# EAGLE design limiter (EAGLE 6.3)
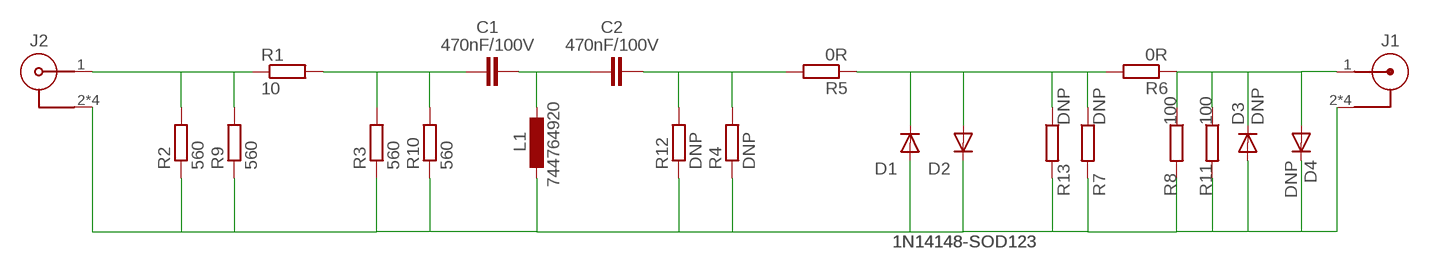
[diagram p0: schematic, sheet 1]

## Parts
C1  470nF/100V  C-EUC0805K  [C0805K]
C2  470nF/100V  C-EUC0805K  [C0805K]
D1  1N14148-SOD123  DIODE-SOD123  [SOD123]
D2  1N14148-SOD123  DIODE-SOD123  [SOD123]
D3  DNP  DIODE-SOD123  [SOD123]
D4  DNP  DIODE-SOD123  [SOD123]
J1  60314202124525  [60314202124525]
J2  60312202114509  [60312202114509]
L1  744764920  L-EUL3225M  [L3225M]
R1  10  R-EU_R0805  [R0805]
R2  560  R-EU_R0805  [R0805]
R3  560  R-EU_R0805  [R0805]
R4  DNP  R-EU_R0805  [R0805]
R5  0R  R-EU_R0805  [R0805]
R6  0R  R-EU_R0805  [R0805]
R7  DNP  R-EU_R0805  [R0805]
R8  100  R-EU_R0805  [R0805]
R9  560  R-EU_R0805  [R0805]
R10  560  R-EU_R0805  [R0805]
R11  100  R-EU_R0805  [R0805]
R12  DNP  R-EU_R0805  [R0805]
R13  DNP  R-EU_R0805  [R0805]

## Nets
GND: D1.A D2.C D3.A D4.C J1.2 J1.3 J1.4 J1.5 J2.2 J2.3 J2.4 J2.5 L1.2 R2.1 R3.1 R4.1 R7.2 R8.2 R9.1 R10.1 R11.2 R12.1 R13.2
N$1: J2.1 R1.1 R2.2 R9.2
N$2: C1.1 R1.2 R3.2 R10.2
N$3: C1.2 C2.1 L1.1
N$5: C2.2 R4.2 R5.2 R12.2
N$7: D1.C D2.A R5.1 R6.2 R7.1 R13.1
N$9: D3.C D4.A J1.1 R6.1 R8.1 R11.1

## Library data of the parts
C1 C2 = rcl:C-EU: CAPACITOR, European symbol
D1-D4 = diode:DIODE-: DIODE
J1 = 60312202111527_Eagle_WR-SMA_rev19a:60314202124525: WR-SMA PCB End Launch Plug Round Post 1.6 mm MATERIAL PROPERTIES Insulator Material PTFE Insulator Color White Center Contact Material Brass Center Contact Plating Gold, min. 0.76µm over Nickel Body Material Brass Body Plating Gold, min. 0.076µm over Nickel Coupling Nut Material Brass Coupling Nut Plating Gold, min. 0.076µm over Nickel KIND PROPERTIES Interface MIL-STD-348 Connector Type SMA Gender Plug Orientation Type Straight GENERAL INFORMATION: Operating Temperature -65 °C up to +165 °C Compliance RoHS ELECTRICAL PROPERTIES: Frequency Range DC~18 GHz MECHANICAL PROPERTIES Mating Cycle 500 Cycles PACKAGING PROPERTIES Packaging Tray <https://katalog.we-online.com/media/images/v2/o122886v209%20WR_SMA_60314202124525.jpg> Details see: https://katalog.we-online.com/en/em/WR-SMA_60314202124525 Updated by Ella Wu 2019-11-07 2019(C) Würth Elektronik; DATASHEET-URL: https://katalog.we-online.com/em/datasheet/60314202124525.pdf; GENDER: Plug; INTERFACE: MIL-STD-348; MOUNT: End Launch; ORIENTATION-TYPE: Straight; PART-NUMBER: 60314202124525; Z: 50Ohm
J2 = 60312202111527_Eagle_WR-SMA_rev19a:60312202114509: WR-SMA PCB End Launch Jack Round Post 1.6 mm MATERIAL PROPERTIES Insulator Material PTFE Insulator Color White Center Contact Material Beryllium Copper Center Contact Plating Gold, min. 0.76µm over Nickel Body Material Brass Body Plating Gold, min. 0.076µm over Nickel KIND PROPERTIES Interface MIL-STD-348 Connector Type SMA Gender Jack Orientation Type Straight GENERAL INFORMATION Operating Temperature -65 °C up to +165 °C Compliance RoHS ELECTRICAL PROPERTIES Frequency Range DC~18 GHz MECHANICAL PROPERTIES Mating Cycle 500 Cycles PACKAGING PROPERTIES Packaging Tray <https://katalog.we-online.com/media/images/v2/o122849v209%20WR-SMA_60312202114509.jpg> Details see: https://katalog.we-online.com/en/em/WR-SMA_60312202114509 Updated by Ella Wu 2019-11-07 2019(C) Würth Elektronik; DATASHEET-URL: https://katalog.we-online.com/em/datasheet/60312202114509.pdf; GENDER: Jack; INTERFACE: MIL-STD-348; MOUNT: End Launch; ORIENTATION-TYPE: Straight; PART-NUMBER: 60312202114509; Z: 50Ohm
L1 = resistor:L-EU: INDUCTOR, European symbol
R1-R13 = rcl:R-EU_: RESISTOR, European symbol

## Board
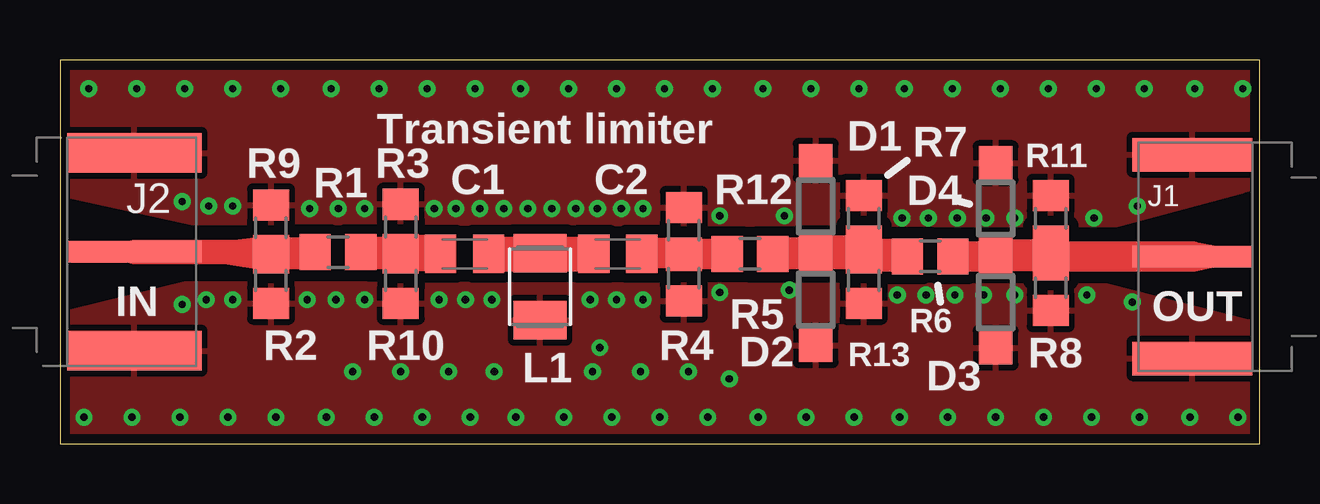
[diagram p1: board, top side]
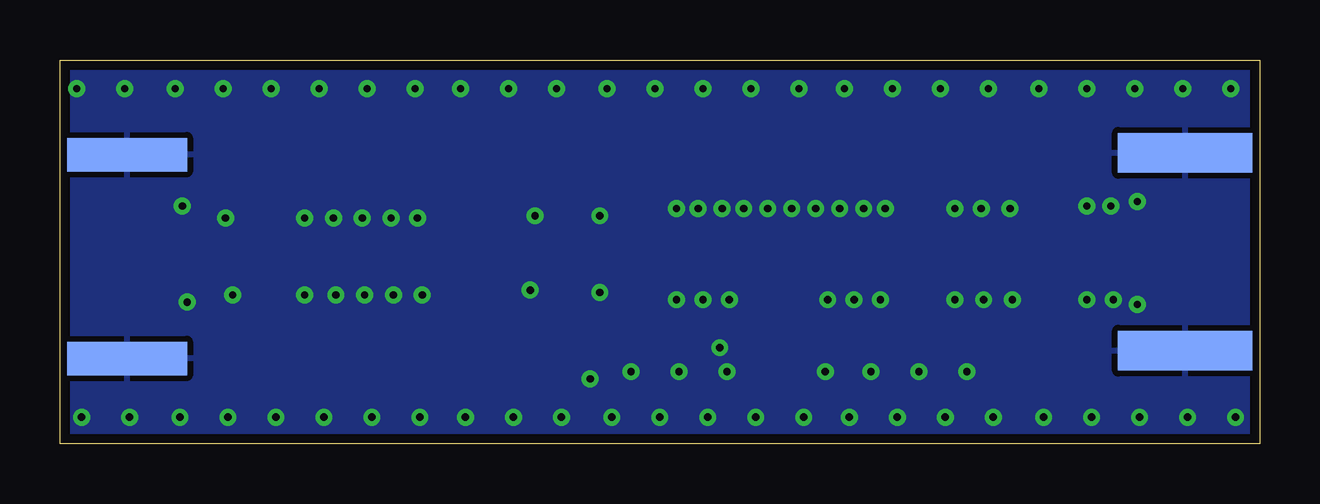
[diagram p2: board, bottom side, seen from below]

Size 50 x 16 mm. Coordinates in mm from the lower left corner, seen from the top.
Outline: 0,0 50,0 50,16 0,16 0,0
Copper layers (1*16): Top 0.035mm / dielectric 1.5mm / Bottom 0.035mm
Design rules "default *": minimum track width 10mil, minimum drill 24mil, track to track 8mil, track to pad 8mil, pad to pad 8mil, via to via 8mil, smd to smd 8mil, copper to edge 0.2mm, drill to drill 8mil, minimum pad ring 10mil, minimum via ring 8mil, stop-mask expansion 4mil, vias tented up to drill 0.35mm, thermal gap 10mil
tRestrict: 6 lines

### Footprints (pad centres in the part's own frame; a part is rotated, then mirrored left to right if it is on the bottom)
C0805K = smd 1.3 x 1.6: 1 -1,0; 2 1,0
SOD123 = smd 1.4 x 1.4: A 1.9,0; C -1.9,0
60314202124525 = smd 0.9 x 5: 1 0,0 | smd 1.4 x 5: 2 -4.25,0; 3 4.25,0 | smd 1.4 x 5 bottom: 4 -4.25,0; 5 4.25,0
60312202114509 = smd 0.9 x 5.6: 1 0,0 | smd 1.65 x 5.6: 2 -4.125,0; 3 4.125,0 | smd 1.65 x 5.6 bottom: 4 -4.125,0; 5 4.125,0
L3225M = smd 1.6 x 2.2: 1 -1.4,0; 2 1.4,0
R0805 = smd 1.3 x 1.5: 1 -0.95,0; 2 0.95,0

### Placement (x,y rotation side)
C1  16.87,7.91 0 top
C2  23.25,7.91 0 top
D1  31.5,9.9 90 top
D2  31.5,6 90 top
D3  39,5.9 270 top
D4  39,9.8 270 top
J1  47.2,7.8 90 top
J2  3.1,8 270 top
L1  20.01,6.54 270 top
R1  11.59,7.98 0 top
R2  8.8,6.8 90 top
R3  14.2,9.03 270 top
R4  26,6.9 90 top
R5  28.76,7.91 180 top
R6  36.27,7.81 180 top
R7  33.5,9.4 90 top
R8  41.3,6.5 270 top
R9  8.8,9 270 top
R10  14.2,6.8 90 top
R11  41.3,9.4 90 top
R12  26,8.9 270 top
R13  33.5,6.8 270 top

### Tracks (layer width: path | path; a pad name or v marks a point on that pad's centre or on a via)
GND  (via drill 0.3)
  other vias: 30.4,6.4 22.5,4 35.1,9.4 36.2,9.4 37.4,9.4 38.6,9.4 39.8,9.4 38.5,6.2 37.3,6.2 34.9,6.2 24.3,6 23.2,6 22.1,6 18,6 16.9,6 15.8,6 12.7,6 11.5,6 10.3,6 24.3,9.8 23.4,9.8 22.4,9.8 21.5,9.8 20.5,9.8 19.5,9.8 18.5,9.8 17.5,9.8 16.5,9.8 15.6,9.8 12.7,9.8 11.6,9.8 10.4,9.8 3.2,14.8 1.2,14.8 7.2,14.8 5.2,14.8 9.2,14.8 11.3,14.8 13.3,14.8 15.3,14.8 17.3,14.8 24.2,3 26.2,3 27.9,2.7 18.1,3 22.2,3 12.2,3 14.2,3 16.2,3 39.8,6.2 21.2,14.8 19.2,14.8 25.2,14.8 23.2,14.8 27.2,14.8 29.3,14.8 31.3,14.8 33.3,14.8 39.2,14.8 37.2,14.8 43.2,14.8 41.2,14.8 45.2,14.8 47.3,14.8 49.3,14.8 35.2,14.8 43.1,9.4 44.7,5.9 42.8,6.2 7.2,9.9 6.2,9.9 5.1,10.1 7.2,6 6.1,6 5.1,5.8 36.1,6.2 44.9,9.9 3,1.1 1,1.1 7,1.1 5,1.1 9,1.1 11.1,1.1 13.1,1.1 15.1,1.1 17.1,1.1 21,1.1 19,1.1 25,1.1 23,1.1 27,1.1 29.1,1.1 31.1,1.1 33.1,1.1 39,1.1 37,1.1 43,1.1 41,1.1 45,1.1 47.1,1.1 49.1,1.1 35,1.1 27.5,6.3 27.5,9.5 30.2,9.5
  pour Top (isolate 0.406): 0.2,15.9 49.9,16 49.9,0 0,0.1
  pour Bottom (isolate 0.406): 0.2,15.9 49.8,15.9 50,0.1 0,0.1
N$1
  Top 0.305: R9.2 R2.2
  Top 1.016: J2.1 8.8,8 8.8,7.96
  Top 1.2: 8.8,7.96 R2.2
  Top 1.27: R1.1 10.56,7.96 8.8,7.96
N$2
  Top 1.27: R1.2 14.2,7.98 R3.2 R10.2 | 15.8,7.98 C1.1
  Top 1.422: 15.8,7.98 14.2,7.98
N$3
  Top 1.27: C2.1 C1.2 17.87,7.94 L1.1
N$4
  Top 0.305: 5.8,7.8 8.3,7.4 8.4,7.4
N$5
  Top 1.016: R4.2 26.06,7.91
  Top 1.2: 25.85,7.85 R4.2 R12.2
  Top 1.27: R12.2 24.25,7.95 C2.2 | 26.06,7.91 R5.2
N$6
  Top 0.305: 8.5,8.5 6.9,8.3
N$7
  Top 0.406: D1.C D2.A
  Top 1.016: R5.1 29.8,8 32,8
  Top 1.27: R13.1 33.5,8 R7.1 | 33.69,7.81 R6.2
  Top 1.422: D1.C 32,8 33.5,8 33.69,7.81
N$8
  Top 0.254: 17.9,8 17.9,7.8
  Top 1.27: 17.9,8 22.2,8 | 17.9,7.8 22.2,7.8
N$9
  Top 1.016: 41.73,7.88 41.81,7.8
  Top 1.2: R8.1 41.73,7.88 | 39.26,7.88 arc-90 D4.A | 41.3,7.88 R11.1
  Top 1.27: D3.C 38.98,7.86 D4.A arc-90 38.79,7.81 R6.1 | 39.26,7.88 41.3,7.88 41.73,7.88 | 41.81,7.8 J1.1
N$10
  Top 0.254: 8.8,7.4 10.7,7.4
N$11
  Top 0.254: 12.2,7.4 15.8,7.4
N$12
  Top 0.254: 15.9,7.3 13.9,7.3
N$13
  Top 0.254: 41.1,7.3 39.3,7.3
N$14
  Top 0.254: 47.3,8.3 48.4,8.1
N$15
  Top 0.254: 47.3,7.3 49.1,7.7
N$16
  Top 1.27: 31,7.9 35.3,7.9
N$17
  Top 0.254: 29.6,7.4 31.3,7.4
N$18
  Top 0.254: 29.7,8.5 31.6,8.5

### Text on the board
tNames: Transient limiter | IN | OUT
bStop: IN (40dBm max) | Out (clamped 0dBm)